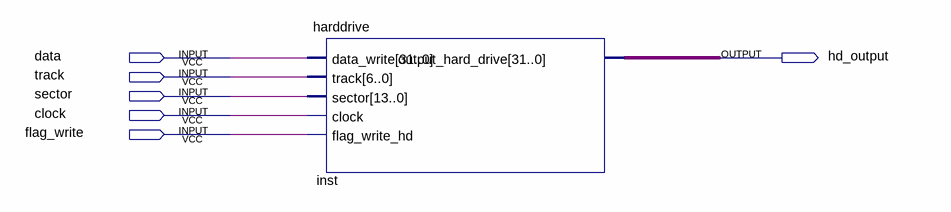
[diagram p0: schematic sheet]
// Quartus schematic hard_drive.bdf as structural Verilog: 1 symbols, 6 pins
module hard_drive (
  input  data,
  input  track,
  input  sector,
  input  clock,
  input  flag_write,
  output hd_output
);

  wire [31:0] inst_output_hard_drive;

  harddrive inst (
    .data_write({32{data}}), .track({7{track}}), .sector({14{sector}}), .clock(clock),
    .flag_write_hd(flag_write), .output_hard_drive(inst_output_hard_drive));
endmodule
